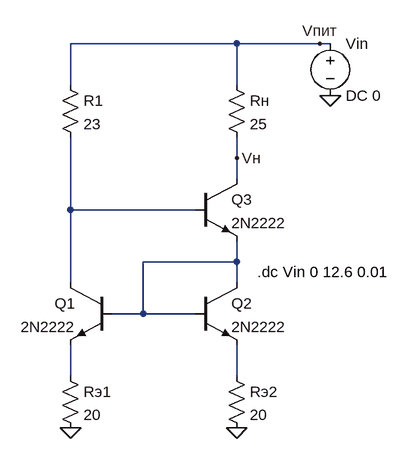
[diagram p0: schematic scheme2.asc]
scheme2.asc, the LTspice schematic file:
Version 4.1
SHEET 1 880 680
WIRE 240 -208 -16 -208
WIRE 368 -208 240 -208
WIRE 384 -208 368 -208
WIRE -16 -144 -16 -208
WIRE 240 -144 240 -208
WIRE 240 -32 240 -64
WIRE 240 0 240 -32
WIRE -16 48 -16 -64
WIRE 176 48 -16 48
WIRE 240 128 240 96
WIRE 240 128 96 128
WIRE -16 160 -16 48
WIRE 240 160 240 128
WIRE 96 208 96 128
WIRE 96 208 48 208
WIRE 176 208 96 208
WIRE -16 304 -16 256
WIRE 240 304 240 256
FLAG -16 384 0
FLAG 240 384 0
FLAG 384 -128 0
FLAG 368 -208 Vпит
FLAG 240 -32 Vн
SYMBOL npn 48 160 M0
SYMATTR InstName Q1
SYMATTR Value 2N2222
SYMBOL npn 176 160 R0
SYMATTR InstName Q2
SYMATTR Value 2N2222
SYMBOL npn 176 0 R0
SYMATTR InstName Q3
SYMATTR Value 2N2222
SYMBOL res -32 -160 R0
SYMATTR InstName R1
SYMATTR Value 23
SYMBOL res 224 -160 R0
SYMATTR InstName Rн
SYMATTR Value 25
SYMBOL res -32 288 R0
SYMATTR InstName Rэ1
SYMATTR Value 20
SYMBOL res 224 288 R0
SYMATTR InstName Rэ2
SYMATTR Value 20
SYMBOL voltage 384 -224 R0
SYMATTR InstName Vin
SYMATTR Value DC 0
TEXT 272 144 Left 2 !.dc Vin 0 12.6 0.01

The netlist it stands for:
* scheme2.asc
Q1 N001 N002 N003 0 2N2222
Q2 N002 N002 N004 0 2N2222
Q3 Vн N001 N002 0 2N2222
R1 Vпит N001 23
Rн Vпит Vн 25
Rэ1 N003 0 20
Rэ2 N004 0 20
Vin Vпит 0 DC 0
.model NPN NPN
.model PNP PNP
.lib standard.bjt
.dc Vin 0 12.6 0.01
.backanno
.end